# Altium schematic sheet AC Conversion and Power.SchDoc: AC Conversion and Power
size Letter; DrawnBy: Leonardo Marquez; Organization: Open Reflow Oven; Address1: leonardomarquez.com; Address2: github.com/marqueztronics; DocumentNumber: 001; Revision: A02; SheetNumber: 2; SheetTotal: 5
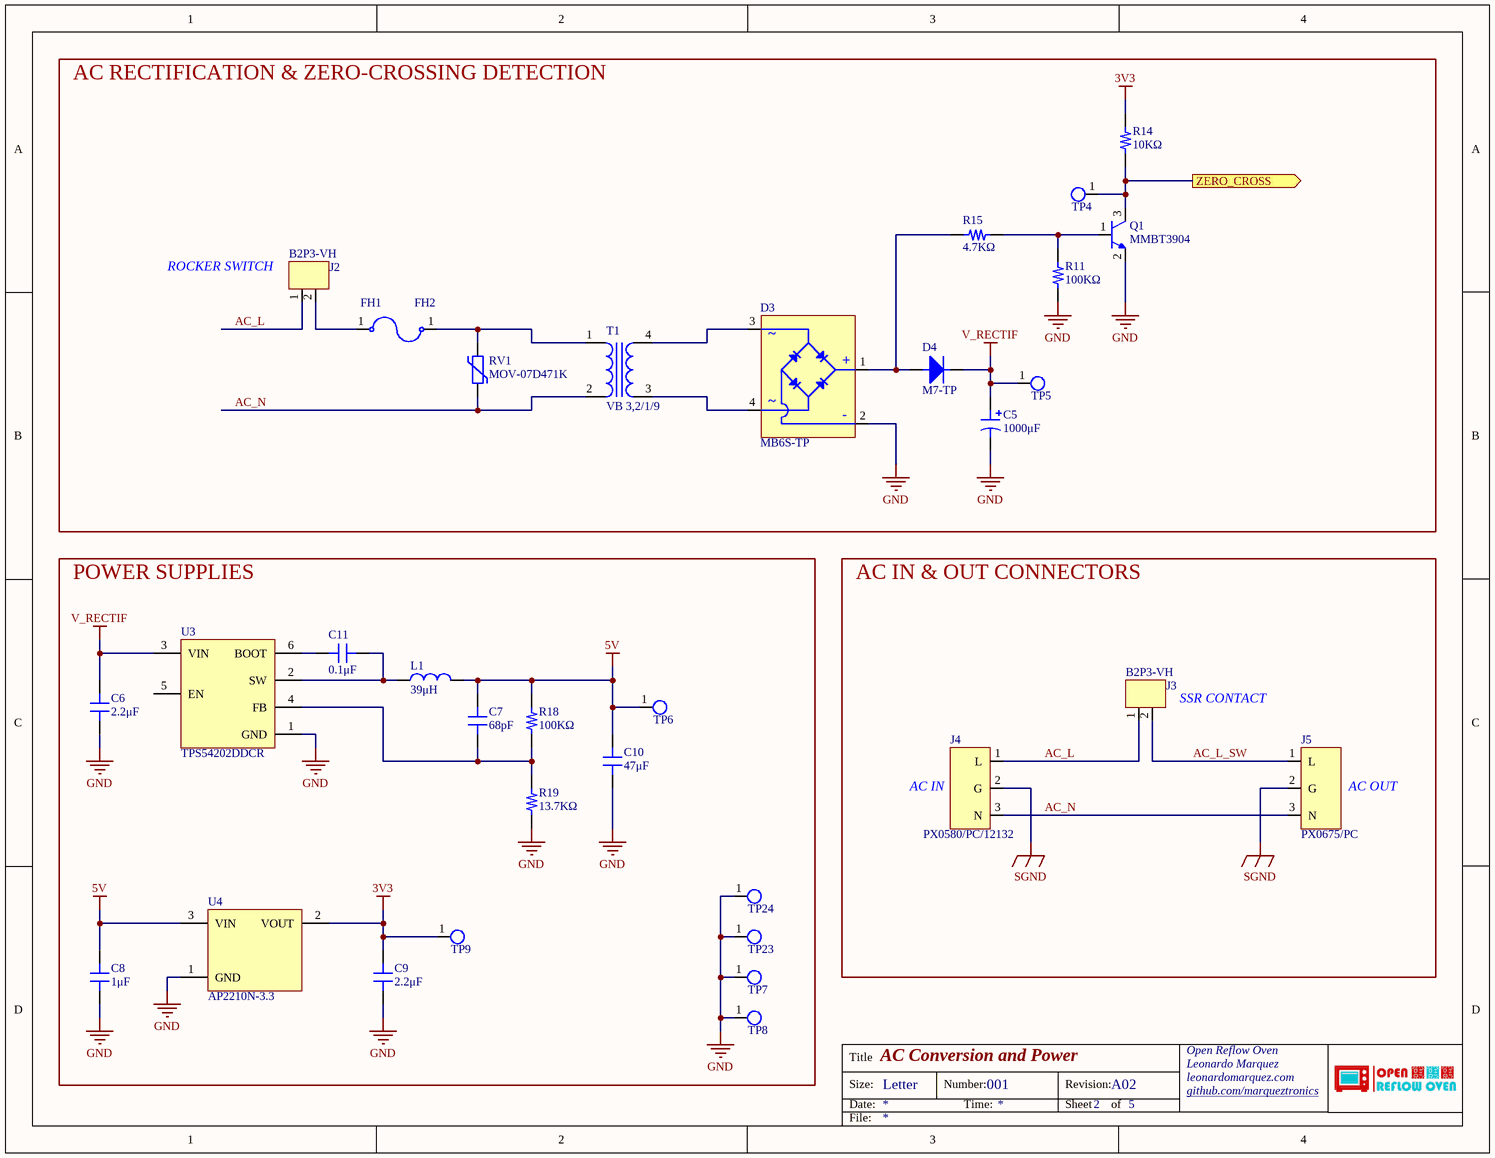
[diagram p0: AC Conversion and Power.SchDoc]

## Parts
C5  1000μF  [CPOL10X20]
C6  2.2μF  [C0805]
C7  68pF  [C0603]
C8  1μF  [C0603]
C9  2.2μF  [C0805]
C10  47μF  [C1210]
C11  0.1μF  [C0603]
D3  MB6S-TP  [MBS-1]
D4  M7-TP  [DO-214AC]
FH1  01000020Z  [100-020]  (value not drawn)
FH2  01000020Z  [100-020]  (value not drawn)
J2  B2P3-VH  [B2P3-VH]
J3  B2P3-VH  [B2P3-VH]
J4  PX0580/PC/12132  [PX0580/PC/12132]
J5  PX0675/PC  [PX0675/PC]
L1  39μH  [L_ASPI-0602S]
Q1  MMBT3904  [SOT-23]
R11  100KΩ  [R0603]
R14  10KΩ  [R0603]
R15  4.7KΩ  [R0603]
R18  100KΩ  [R0603]
R19  13.7KΩ  [R0603]
RV1  MOV-07D471K  [MOV-07D471K]
T1  VB 3,2/1/9  [VB_3,2/1/9]
TP4  TP-1MM-ROUND  [TP-1MM-ROUND]  (value not drawn)  (no BOM)
TP5  TP-1MM-ROUND  [TP-1MM-ROUND]  (value not drawn)  (no BOM)
TP6  TP-1MM-ROUND  [TP-1MM-ROUND]  (value not drawn)  (no BOM)
TP7  TP-1MM-ROUND  [TP-1MM-ROUND]  (value not drawn)  (no BOM)
TP8  TP-1MM-ROUND  [TP-1MM-ROUND]  (value not drawn)  (no BOM)
TP9  TP-1MM-ROUND  [TP-1MM-ROUND]  (value not drawn)  (no BOM)
TP23  TP-1MM-ROUND  [TP-1MM-ROUND]  (value not drawn)  (no BOM)
TP24  TP-1MM-ROUND  [TP-1MM-ROUND]  (value not drawn)  (no BOM)
U3  TPS54202DDCR  [SOT-23-6]
U4  AP2210N-3.3  [SOT-23]

## Blocks framed on the sheet
AC RECTIFICATION & ZERO-CROSSING DETECTION: C5 D3 D4 FH1 FH2 J2 Q1 R11 R14 R15 RV1 T1 TP4 TP5
POWER SUPPLIES: C6-C11 L1 R18 R19 TP6-TP9 TP23 TP24 U3 U4
AC IN & OUT CONNECTORS: J3-J5

## Ports
ZERO_CROSS (out)

## Nets
3V3: C9.2 R14.2 TP9.1 U4.2(VOUT)
5V: C7.2 C8.2 C10.2 L1.2 R18.2 TP6.1 U4.3(VIN)
GND: C5.2 C6.1 C8.1 C9.1 C10.1 D3.2(-) Q1.2(E) R11.1 R19.1 TP7.1 TP8.1 TP23.1 TP24.1 U3.1(GND) U4.1(GND)
SGND: J4.2(G) J5.2(G)
V_RECTIF: C5.1 C6.2 D4.K TP5.1 U3.3(VIN)
AC_L: J2.1 J3.1 J4.1(L)
AC_L_SW: J3.2 J5.1(L)
AC_N: J4.3(N) J5.3(N) RV1.1 T1.2
ZERO_CROSS: Q1.3(C) R14.1 TP4.1 ; port ZERO_CROSS
NetC7_1: C7.1 R18.1 R19.2 U3.4(FB)
NetC11_1: C11.1 L1.1 U3.2(SW)
NetC11_2: C11.2 U3.6(BOOT)
NetD3_1: D3.1(+) D4.A R15.1
NetD3_3: D3.3 T1.4
NetD3_4: D3.4 T1.3
NetFH1_1: FH1.1 J2.2
NetFH2_1: FH2.1 RV1.2 T1.1
NetQ1_1: Q1.1(B) R11.2 R15.2

Not connected (* = marked no-connect by the designer): U3 5(EN)

## Notes on the sheet
- (near J2) ROCKER SWITCH
- (near J3) SSR CONTACT
- (near J4) AC IN
- (near J5) AC OUT
- Title
- Size:
- Date:
- Letter
- Number:
- Time:
- Revision:
- Sheet
- of
- File:

## Library data of the parts
C5 = C-1000UF-16V-CPOL10X20: 1000uF 16V 78mΩ@100kHz ±20% 1.05A@100kHz Plugin,D10xL20mm Aluminum Electrolytic Capacitors - Leaded ROHS; Manufacturer: Rubycon; Manufacturer Part Number: 16YXF1000MEFC10X20; Price Unit: 0.1397; Price 1K: 0.0774; Supplier 1: LCSC; Supplier Part Number 1: C110138
C6 C9 = C-2.2UF-35V-X7R-C0805: 35V 2.2uF X7R ±10% 0805 Multilayer Ceramic Capacitors MLCC - SMD/SMT ROHS; Manufacturer: TDK; Manufacturer Part Number: CGA4J1X7R1V225KT0Y0E; Price Unit: 0.1161; Price 1K: 0.0724; Supplier 1: LCSC; Supplier Part Number 1: C342739
C7 = C-68PF-50V-NP0-C0603: 50V 68pF NP0 ±5% 0603 Multilayer Ceramic Capacitors MLCC - SMD/SMT ROHS; Manufacturer: Yageo; Manufacturer Part Number: CC0603JRNPO9BN680; Price Unit: 0.0027; Price 1K: 0.0021; Supplier 1: LCSC; Supplier Part Number 1: C62782
C8 = C-1UF-16V-X7R-C0603: 16V 1uF X7R ±10% 0603 Multilayer Ceramic Capacitors MLCC - SMD/SMT ROHS; Manufacturer: Samsung Electro-Mechanics; Manufacturer Part Number: CL10B105KO8NNNC; Price Unit: 0.0033; Price 1K: 0.0029; Supplier 1: LCSC; Supplier Part Number 1: C59782
C10 = C-47UF-16V-X5R-C1210: 16V 47uF X5R ±10% 1210 Multilayer Ceramic Capacitors MLCC - SMD/SMT ROHS; Manufacturer: Murata; Manufacturer Part Number: GRM32ER61C476KE15L; Price Unit: 0.1302; Price 1K: 0.079; Supplier 1: LCSC; Supplier Part Number 1: C77101
C11 = C-0.1UF-50V-X7R-C0603: 50V 100nF X7R ±10% 0603 Multilayer Ceramic Capacitors MLCC - SMD/SMT ROHS; Manufacturer: Samsung Electro-Mechanics; Manufacturer Part Number: CL10B104KB8NNNC; Price Unit: 0.0024; Price 1K: 0.0019; Supplier 1: LCSC; Supplier Part Number 1: C1591
D3 = D-BRIDGE-RECTIFIER-600V-0.5A-MBS-1: 35A 1V@400mA 800mA 600V MBS Bridge Rectifiers ROHS; Manufacturer: Micro Commercial Components; Manufacturer Part Number: MB6S-TP; Price Unit: 0.0398; Price 1K: 0.0284; Supplier 1: LCSC; Supplier Part Number 1: C85619
D4 = D-1KV-1A-DO-214AC: 1A 1kV 1.1V@1A SMA(DO-214AC) Diodes - General Purpose ROHS; Manufacturer: Micro Commercial Components; Manufacturer Part Number: M7-TP; Price Unit: 0.013; Price 1K: 0.0104; Supplier 1: LCSC; Supplier Part Number 1: C85148
FH1 FH2 = FH-1P-5X20MM-100-020: Circuit Board Mount Fuse Clips for 5mm Diameter Fuses; Manufacturer: Littelfuse; Manufacturer Part Number: 01000020Z; Price Unit: 0.206; Price 1K: 0.1324; Supplier 1: LCSC; Supplier Part Number 1: C142797
J2 J3 = J-2P-7.92MM-B2P3-VH: 1x2P 2P VH 1 7.92mm 2 Brass Plugin,P=7.92mm Wire To Board Connector ROHS; Manufacturer: JST; Manufacturer Part Number: B2P3-VH(LF)(SN); Price Unit: 0.0558; Price 1K: 0.0310; Supplier 1: LCSC; Supplier Part Number 1: C160745
J4 = J-3P-IEC-C14-PX0580/PC/12132: C14 Right Angle Panel Mount, PCB Mount IEC Connector Male, 10A, 250 V; Manufacturer: Bulgin; Manufacturer Part Number: PX0580/PC/12132; Price Unit: 5.03; Price 1K: 4.37; Supplier 1: RS; Supplier Part Number 1: 261-5840
J5 = J-3P-IEC-C14-PX0675/PC: C13 Right Angle Panel Mount, PCB Mount IEC Connector Socket, 10A, 250 V; Manufacturer: Bulgin; Manufacturer Part Number: PX0675/PC; Price Unit: 6.49; Price 1K: 5.45; Supplier 1: RS; Supplier Part Number 1: 801-948
L1 = L-39UH-860MA-L_ASPI-0602S: 860mA 39uH ±20% SMD,6.7x6.7mm Power Inductors ROHS; Manufacturer: Abracon; Manufacturer Part Number: ASPI-0602S-390M-T; Price Unit: 0.0798; Price 1K: 0.0437; Supplier 1: LCSC; Supplier Part Number 1: C187310
Q1 = Q-NPN-40V-0.2A-SOT-23: 40V 250mW 200mA NPN SOT-23 Bipolar Transistors - BJT ROHS; Manufacturer: Nexperia; Manufacturer Part Number: MMBT3904; Price Unit: 0.0155; Price 1K: 0.0124; Supplier 1: LCSC; Supplier Part Number 1: C108429
R11 R18 = R-100K-1/10W-R0603: 100mW Thick Film Resistors 75V ±100ppm/℃ ±1% 100kΩ 0603 Chip Resistor - Surface Mount ROHS; Manufacturer: Yageo; Manufacturer Part Number: RC0603FR-07100KL; Price Unit: 0.0009; Price 1K: 0.0007; Supplier 1: LCSC; Supplier Part Number 1: C14675
R14 = R-10K-1/10W-R0603: 100mW Thick Film Resistors 75V ±100ppm/℃ ±1% 10kΩ 0603 Chip Resistor - Surface Mount ROHS; Manufacturer: Yageo; Manufacturer Part Number: RC0603FR-0710KL; Price Unit: 0.0009; Price 1K: 0.0007; Supplier 1: LCSC; Supplier Part Number 1: C98220
R15 = R-4.7K-1/10W-R0603: 100mW Thick Film Resistors 75V ±100ppm/℃ ±1% 4.7kΩ 0603 Chip Resistor - Surface Mount ROHS; Manufacturer: Yageo; Manufacturer Part Number: RC0603FR-074K7L; Price Unit: 0.001; Price 1K: 0.0008; Supplier 1: LCSC; Supplier Part Number 1: C99782
R19 = R-13.7K-1/10W-R0603: 100mW Thick Film Resistors 75V ±100ppm/℃ ±1% 13.7kΩ 0603 Chip Resistor - Surface Mount ROHS; Manufacturer: Yageo; Manufacturer Part Number: RC0603FR-0713K7L; Price Unit: 0.0013; Price 1K: 0.001; Supplier 1: LCSC; Supplier Part Number 1: C482771
RV1 = RV-470V-1.2KA-MOV-07D471K: VARISTOR 470V 1.2KA DISC 7MM; Manufacturer: Bourns; Manufacturer Part Number: MOV-07D471K; Price Unit: 0.0857; Price 1K: 0.0532; Supplier 1: LCSC; Supplier Part Number 1: C1527385
T1 = T-230V-9V-VB_3,2/1/9: Block 9V ac 1 Output Through Hole PCB Transformer, 3.2VA; Manufacturer: Block; Manufacturer Part Number: VB 3,2/1/9; Price Unit: 7.24; Price 1K: 7.24; Supplier 1: RS; Supplier Part Number 1: 732-0398
TP4-TP9 TP23 TP24 = TP-1MM-ROUND: Round Test Point 1mm Dia
U3 = U-TPS54202DDCR-SOT-23-6: 4.5-V to 28-V Input, 2-A Output, EMI Friendly  Synchronous Step Down Converter; Manufacturer: Texas Instruments; Manufacturer Part Number: TPS54202DDCR; Price Unit: 0.1566; Price 1K: 0.0922; Supplier 1: LCSC; Supplier Part Number 1: C191884
U4 = U-AP2210N-3.3TRG1-SOT-23: 300mA 75dB@(100Hz) Fixed 3.3V Positive electrode 13.2V SOT-23 Linear Voltage Regulators (LDO) ROHS; Manufacturer: Diodes Incorporated; Manufacturer Part Number: AP2210N-3.3TRG1; Price Unit: 0.0907; Price 1K: 0.0597; Supplier 1: LCSC; Supplier Part Number 1: C155508